# Altium schematic sheet Info.SchDoc
size A4; SheetNumber: 1; SheetTotal: 8
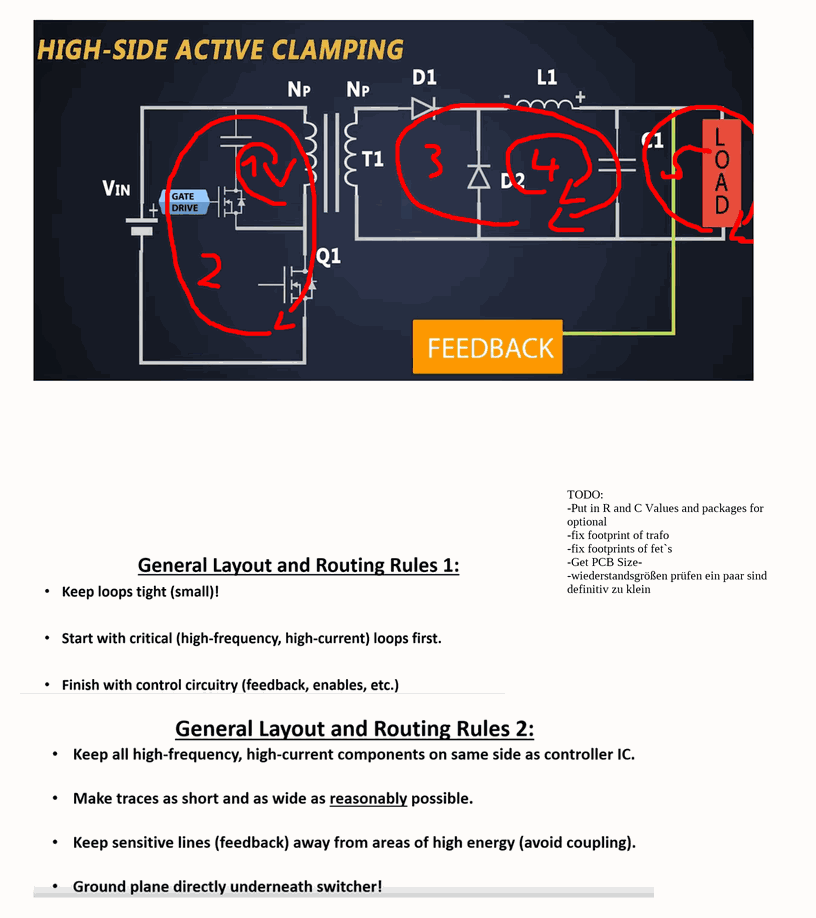
[diagram p0: Info.SchDoc]

## Notes on the sheet
- TODO:
  -Put in R and C Values and packages for optional
  -fix footprint of trafo
  -fix footprints of fet`s
  -Get PCB Size-
  -wiederstandsgrößen prüfen ein paar sind definitiv zu klein